# EAGLE design hall_sensor_break_out (EAGLE 7.5.0)
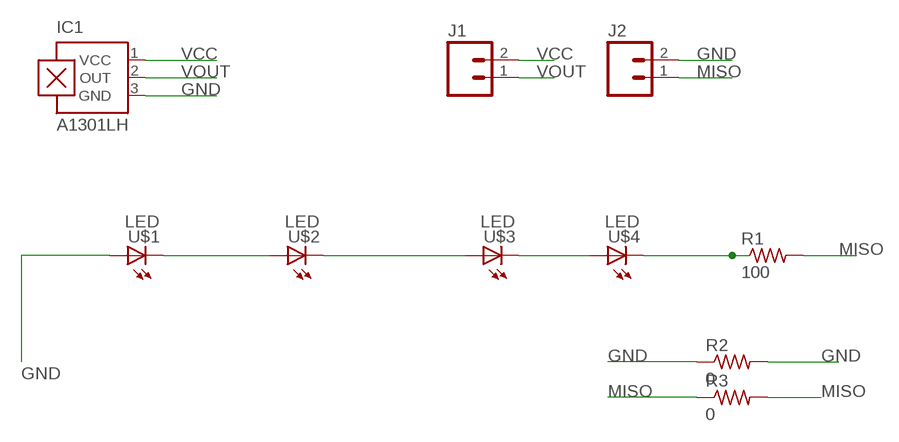
[diagram p0: schematic, sheet 1]

## Parts
IC1  A1301LH  [SOT23-W]
J1  M02POLAR_LOCK  [MOLEX-1X2_LOCK]
J2  M02POLAR_LOCK  [MOLEX-1X2_LOCK]
R1  100  RES-US1206FAB  [R1206FAB]
R2  0  RES-US1206FAB  [R1206FAB]
R3  0  RES-US1206FAB  [R1206FAB]
U$1  LED  [LED1206]
U$2  LED  [LED1206]
U$3  LED  [LED1206]
U$4  LED  [LED1206]

## Nets
GND: IC1.3(GND) J2.2 R2.1 R2.2 U$1.1(A)
MISO: J2.1 R1.2 R3.1 R3.2
N$1: U$1.2(C) U$2.1(A)
N$2: U$2.2(C) U$3.1(A)
N$3: U$3.2(C) U$4.1(A)
N$4: R1.1 U$4.2(C)
VCC: IC1.1(VCC) J1.2
VOUT: IC1.2(OUT) J1.1

## Library data of the parts
IC1 = allegro:A13*?: Linear Hall Effect Sensor ICs Continuous-Time Ratiometric High-Temperature Operation Programmable Linear with Analog Output A1302 -Replacement- UGN3503 Source: http://www.allegromicro.com/en/Products/Part_Numbers/1301/1301.pdf http://www.allegromicro.com/en/Products/Part_Numbers/1321/1321.pdf http://www.allegromicro.com/en/Products/Part_Numbers/1381/1381.pdf; MF: ALLEGRO MICROSYSTEMS, INC.; MPN: A1301ELHLT-T; OC_FARNELL: 1198084; OC_NEWARK: 31K6634
J1 J2 = SparkFun-Connectors:M02: Standard 2-pin 0.1" header. Use with - straight break away headers ( PRT-00116) - right angle break away headers (PRT-00553) - swiss pins (PRT-00743) - machine pins (PRT-00117) - female headers (PRT-00115) Molex polarized connector foot print use with: PRT-08233 with associated crimp pins and housings. 2.54_SCREWTERM for use with PRT-10571. 3.5mm Screw Terminal footprints for PRT-08084 5mm Screw Terminal footprints for use with PRT-08432
R1-R3 = fab:RES-US: Resistor (US Symbol) Variants with postfix FAB are widened to allow the routing of internal traces
U$1-U$4 = fab:LED: LED

## Board
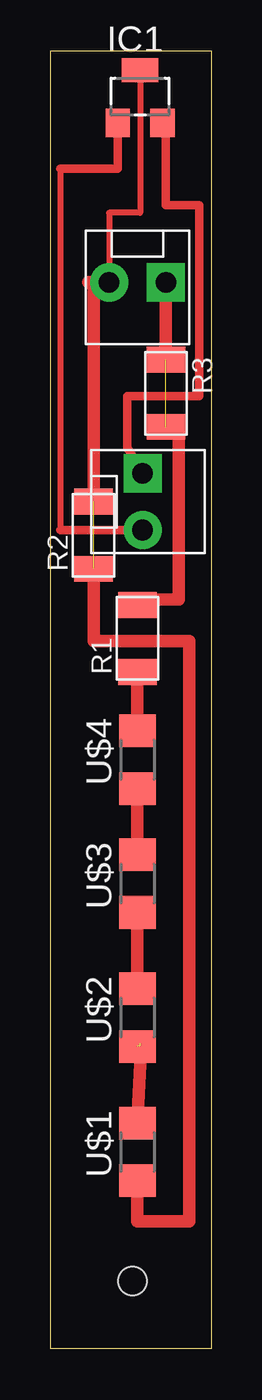
[diagram p1: board, top side]

Size 7.89 x 63.89 mm. Coordinates in mm from the lower left corner, seen from the top.
Outline: 7.89,63.89 7.89,0 0,0 0,63.89 7.89,63.89
Copper layers (1*16): Top 0.035mm / dielectric 1.5mm / Bottom 0.035mm
Design rules "default *": minimum track width 10mil, minimum drill 24mil, track to track 16mil, track to pad 16mil, pad to pad 16mil, via to via 16mil, smd to smd 16mil, copper to edge 40mil, drill to drill 8mil, minimum pad ring 10mil, minimum via ring 8mil, stop-mask expansion 4mil, vias tented up to drill 0mil, thermal gap 10mil
Holes 1.4 mm at 4.01,3.34

### Footprints (pad centres in the part's own frame; a part is rotated, then mirrored left to right if it is on the bottom)
SOT23-W = smd 1.2 x 1.4: 1 -1.1,-1.3; 2 1.1,-1.3 | smd 1.8 x 1.2: 3 0,1.3
MOLEX-1X2_LOCK = drill 1.016 pad 1.88 square: 1 -0.127,0 | drill 1.016 pad 1.88: 2 2.667,0
R1206FAB = smd 1.27 x 1.905: 1 -1.651,0; 2 1.651,0
LED1206 = smd 1.6 x 1.803: 1 -1.422,0; 2 1.422,0

### Placement (x,y rotation side)
IC1  4.39,61.63 0 top
J1  4.52,42.96 270 top
J2  5.54,52.49 180 top
R1  4.27,34.96 90 top
R2  2.11,40.04 90 top
R3  5.66,47.03 270 top
U$1  4.27,9.69 90 top
U$2  4.27,16.29 90 top
U$3  4.27,22.9 90 top
U$4  4.27,28.99 90 top

### Tracks (layer width: path | path; a pad name or v marks a point on that pad's centre or on a via)
GND  (1 unrouted)
  Top 0.305: IC1.3 4.39,55.92 2.87,55.92 J2.2
  Top 0.61: U$1.1 4.27,6.26 6.81,6.26 6.81,34.84 2.11,34.84 R2.1 | J2.2 1.85,52.49 2.11,52.23 R2.2
MISO  (1 unrouted)
  Top 0.406: J2.1 5.66,51.85 | 5.66,51.85 5.28,51.85 | 6.04,51.85 5.66,51.85
  Top 0.61: R1.2 4.27,36.87 6.3,36.87 6.3,45.38 R3.2 | R3.1 J2.1
N$1  (2 unrouted)
  Top 0.61: U$1.2 4.39,14.01 4.39,15.02
N$2
  Top 0.61: 4.27,18.43 U$2.2 U$3.1
N$3
  Top 0.61: U$3.2 U$4.1
N$4
  Top 0.61: U$4.2 R1.1
VCC
  Top 0.305: 0.46,58.08 0.46,40.3
  Top 0.406: IC1.1 3.29,58.08 0.46,58.08 | 0.46,40.3 J1.2
VOUT
  Top 0.406: IC1.2 5.49,60.11 5.66,60.11 5.66,56.3 7.31,56.3 7.31,46.9 3.76,46.9 3.76,44.36 J1.1